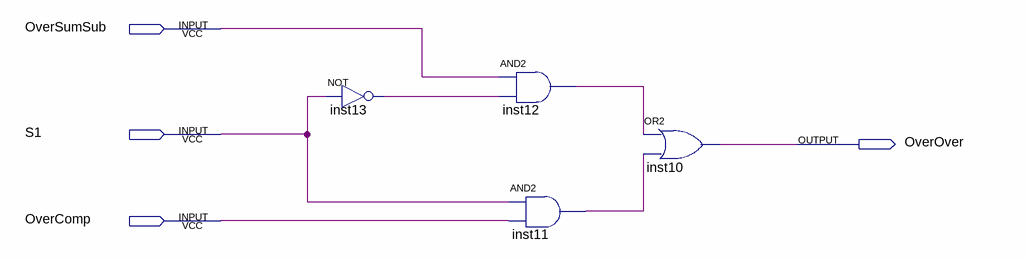
[diagram p0: schematic sheet]
// Quartus schematic OutroMux.bdf as structural Verilog: 4 symbols, 4 pins
module OutroMux (
  input  OverSumSub,
  input  S1,
  input  OverComp,
  output OverOver
);

  wire inst11_out, inst12_out, inst13_out;

  not inst13 (inst13_out, S1);
  and inst12 (inst12_out, OverSumSub, inst13_out);
  and inst11 (inst11_out, S1, OverComp);
  or inst10 (OverOver, inst12_out, inst11_out);
endmodule
